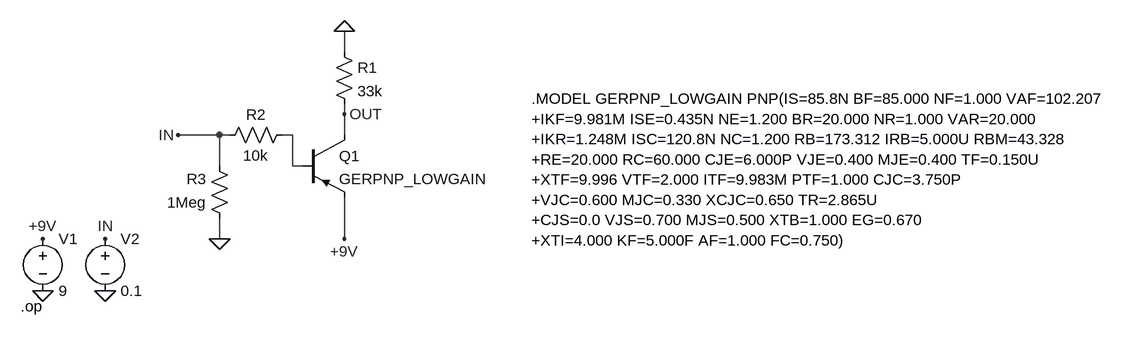
[diagram p0: schematic PNP_Fuzz_Simulation.asc]
PNP_Fuzz_Simulation.asc, the LTspice schematic file:
Version 4
SHEET 1 1408 680
WIRE 192 64 192 32
WIRE 192 160 192 144
WIRE 0 192 -64 192
WIRE 16 192 0 192
WIRE 112 192 96 192
WIRE 192 192 192 160
WIRE 0 240 0 192
WIRE 112 240 112 192
WIRE 128 240 112 240
WIRE 0 352 0 320
WIRE 192 352 192 288
FLAG 192 32 0
FLAG -64 192 IN
FLAG 192 160 OUT
FLAG 192 352 +9V
FLAG 0 352 0
FLAG -272 432 0
FLAG -176 432 0
FLAG -272 352 +9V
FLAG -176 352 IN
SYMBOL res 176 48 R0
SYMATTR InstName R1
SYMATTR Value 33k
SYMBOL res 112 176 R90
WINDOW 0 0 56 VBottom 2
WINDOW 3 32 56 VTop 2
SYMATTR InstName R2
SYMATTR Value 10k
SYMBOL res 16 336 R180
WINDOW 0 36 76 Left 2
WINDOW 3 36 40 Left 2
SYMATTR InstName R3
SYMATTR Value 1Meg
SYMBOL voltage -272 336 R0
WINDOW 123 0 0 Left 0
WINDOW 39 0 0 Left 0
SYMATTR InstName V1
SYMATTR Value 9
SYMBOL voltage -176 336 R0
WINDOW 123 0 0 Left 0
WINDOW 39 0 0 Left 0
SYMATTR InstName V2
SYMATTR Value 0.1
SYMBOL pnp 128 192 R0
SYMATTR InstName Q1
SYMATTR Value GERPNP_LOWGAIN
TEXT -306 456 Left 2 !.op
TEXT 480 136 Left 2 !.MODEL GERPNP_LOWGAIN PNP(IS=85.8N BF=85.000 NF=1.000 VAF=102.207\n+IKF=9.981M ISE=0.435N NE=1.200 BR=20.000 NR=1.000 VAR=20.000\n+IKR=1.248M ISC=120.8N NC=1.200 RB=173.312 IRB=5.000U RBM=43.328\n+RE=20.000 RC=60.000 CJE=6.000P VJE=0.400 MJE=0.400 TF=0.150U\n+XTF=9.996 VTF=2.000 ITF=9.983M PTF=1.000 CJC=3.750P\n+VJC=0.600 MJC=0.330 XCJC=0.650 TR=2.865U\n+CJS=0.0 VJS=0.700 MJS=0.500 XTB=1.000 EG=0.670\n+XTI=4.000 KF=5.000F AF=1.000 FC=0.750)

The netlist it stands for:
* PNP_Fuzz_Simulation.asc
R1 0 OUT 33k
R2 N001 IN 10k
R3 0 IN 1Meg
V1 +9V 0 9
V2 IN 0 0.1
Q1 OUT N001 +9V 0 GERPNP_LOWGAIN
.model NPN NPN
.model PNP PNP
.lib standard.bjt
.op
.MODEL GERPNP_LOWGAIN PNP(IS=85.8N BF=85.000 NF=1.000 VAF=102.207
+IKF=9.981M ISE=0.435N NE=1.200 BR=20.000 NR=1.000 VAR=20.000
+IKR=1.248M ISC=120.8N NC=1.200 RB=173.312 IRB=5.000U RBM=43.328
+RE=20.000 RC=60.000 CJE=6.000P VJE=0.400 MJE=0.400 TF=0.150U
+XTF=9.996 VTF=2.000 ITF=9.983M PTF=1.000 CJC=3.750P
+VJC=0.600 MJC=0.330 XCJC=0.650 TR=2.865U
+CJS=0.0 VJS=0.700 MJS=0.500 XTB=1.000 EG=0.670
+XTI=4.000 KF=5.000F AF=1.000 FC=0.750)
.backanno
.end